# Altium project RBEComponentTester.PrjPcb
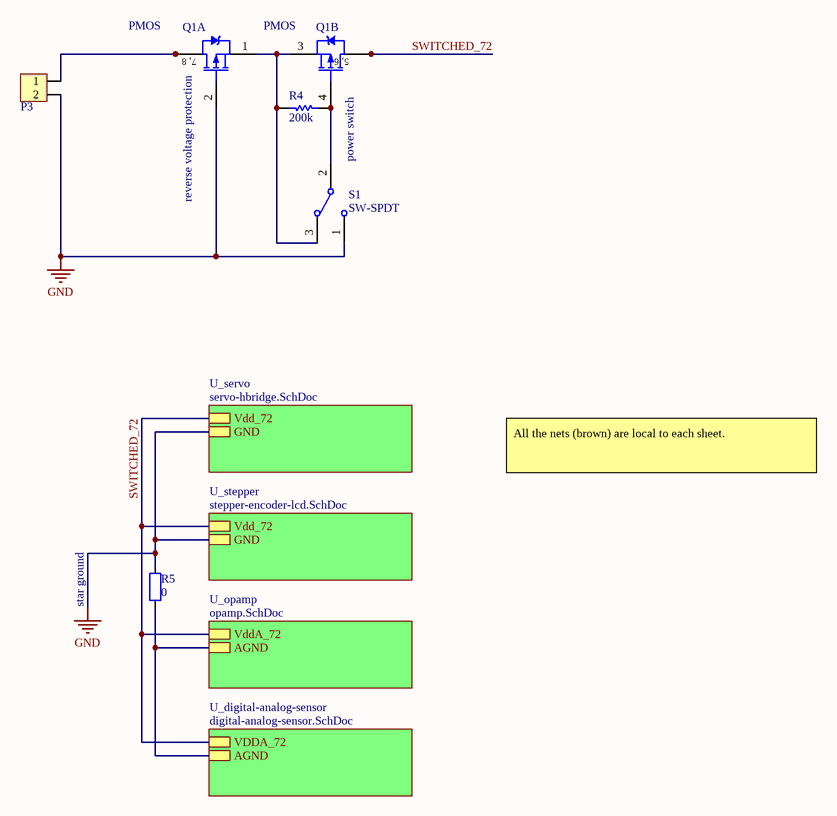
[diagram p0: main.SchDoc]
5 sheets, 127 parts. Net scope: strictly hierarchical (ports join the sheet entries above them; power ports are local).
Board file: PCB1.PcbDoc
Sheets:
  main.SchDoc
    U_digital-analog-sensor = digital-analog-sensor.SchDoc
    U_servo = servo-hbridge.SchDoc
    U_stepper = stepper-encoder-lcd.SchDoc
    U_opamp = opamp.SchDoc

## Sheet main.SchDoc
size A

### Parts
P3  2Way_5  [2Way_5]  (value not drawn)
Q1  PMOS  [SOIC_E200_8]  (parts A,B of 2)
R4  value 200k  [RES_0805]  (hidden comment: Res)
R5  value 0  [RES_0805]  (hidden comment: Res_0805)
S1  SW-SPDT  [G3T-12AH]

### Sub-sheets
U_digital-analog-sensor = digital-analog-sensor.SchDoc: VDDA_72, AGND
U_opamp = opamp.SchDoc: VddA_72, AGND
U_servo = servo-hbridge.SchDoc: Vdd_72, GND
U_stepper = stepper-encoder-lcd.SchDoc: Vdd_72, GND

### Nets
AGND: R5.1 ; sheet U_digital-analog-sensor/AGND, sheet U_opamp/AGND
GND: P3.2 Q1.2(G) R5.2 S1.1 ; sheet U_servo/GND, sheet U_stepper/GND
SWITCHED_72: Q1.5(D) Q1.6(D) ; sheet U_digital-analog-sensor/VDDA_72, sheet U_servo/Vdd_72, sheet U_stepper/Vdd_72, sheet U_opamp/VddA_72
NetP3_1: P3.1 Q1.7(D) Q1.8(D)
NetQ1_1: Q1.1(S) Q1.3(S) R4.1 S1.3
NetQ1_4: Q1.4(G) R4.2 S1.2

### Notes on the sheet
- (near Q1) reverse voltage protection
- (near Q1) power switch
- All the nets (brown) are local to each sheet.
- star ground
- (in symbol IRF7316, part A) 7, 8
- (in symbol IRF7316, part B) 5, 6

### Library data of the parts
P3 = 2Way_5: DB
Q1 = IRF7316: Dual PMOS; Published: 8-Jun-2000; LatestRevisionDate: 13-Apr-2006; LatestRevisionNote: IPC-7351 Footprint Added.; DatasheetVersion: Aug-1997; PackageVersion: Feb-2001; PackageReference: SO-8; Publisher: Altium Limited; PackageDescription: 8-Pin Plastic Small Outline Integrated Circuit 1.27 mm Pitch; Code_JEDEC: MS-012-AA; Code_IPC: SOIC127P600-8; ComponentLink1Description: Manufacturer Link; ComponentLink1URL: http://www.irf.com/; ComponentLink2Description: Datasheet; ComponentLink2URL: http://www.irf.com/product-info/datasheets/data/irf7316.pdf
R4 = Res1: Resistor; Published: 8-Jun-2000; LatestRevisionDate: 17-Jul-2002; LatestRevisionNote: Re-released for DXP Platform.; PackageReference: AXIAL-0.3; Publisher: Altium Limited
R5 = Res_0805: Resistor
S1 = SW-SPDT: SPDT Subminiature Toggle Switch, Right Angle Mounting, Vertical Actuation; Published: 24-Mar-1999; LatestRevisionDate: 17-Dec-2003; LatestRevisionNote: Schematic revised, PCB Footprint replaced.; DatasheetVersion: 05-Dec-2000; PackageReference: TL36WW15050; Publisher: Altium Limited; PackageDescription: Switch; 4 Leads; ComponentLink1Description: Manufacturer Link; ComponentLink1URL: http://www.apem.com

## Sheet digital-analog-sensor.SchDoc
size A
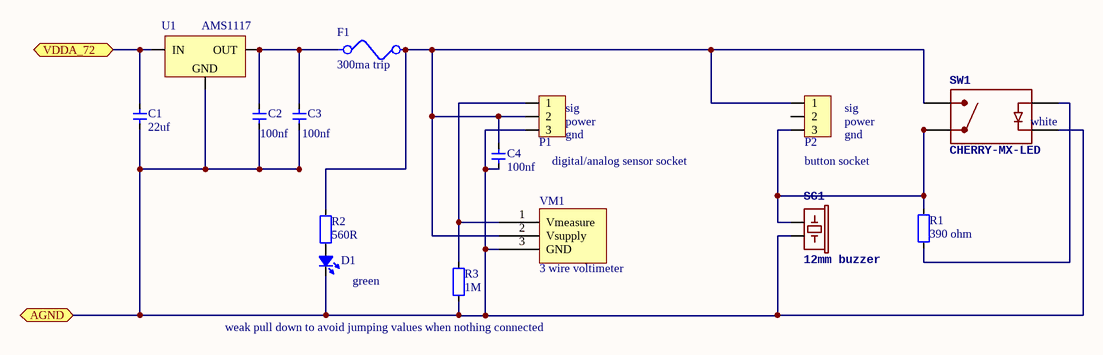
[diagram p1: digital-analog-sensor.SchDoc]

### Parts
C1  value 22uf  [CAP_0805]  (hidden comment: Cap_0805)
C2  value 100nf  [CAP_0805]  (hidden comment: Cap_0805)
C3  value 100nf  [CAP_0805]  (hidden comment: Cap_0805)
C4  value 100nf  [CAP_0805]  (hidden comment: Cap_0805)
D1  LED_0805  [LED_0805_RED]  (value not drawn)
F1  300ma trip  [Multifuse1812]
P1  HDR1x3_2.54  [HDR1X3_2.54_180]  (value not drawn)
P2  HDR1x3_2.54  [HDR1X3_2.54_180]  (value not drawn)
R1  value 390 ohm  [RES_0805]  (hidden comment: Res_0805)
R2  value 560R  [RES_0805]  (hidden comment: Res_0805)
R3  weak pull down to avoid jumping values when nothing connected  value 1M  [RES_0805]
SG1  12mm buzzer  [BUZZER-12MM]
SW1  CHERRY-MX-LED  [MX-LED]
U1  AMS1117  [SOT223-3-CONNECTEDTAB]
VM1  3 wire voltimeter  [led_meter_0.36]

### Ports
AGND, VDDA_72

### Nets
AGND: C1.1 C2.1 C3.1 C4.1 D1.2(K) P1.3 R3.1 SG1.- SW1.P$3 U1.1(GND) VM1.3(GND) ; port AGND
SWITCHED_72: C1.2 U1.3(IN) ; port VDDA_72
NetC2_2: C2.2 C3.2 F1.2 U1.2(OUT)
NetC4_2: C4.2 F1.1 P1.2 P2.1 R2.2 SW1.P$2 VM1.2(Vsupply)
NetD1_1: D1.1(A) R2.1
NetP1_1: P1.1 R3.2 VM1.1(Vmeasure)
NetP2_3: P2.3 R1.2 SG1.+ SW1.P$1
NetR1_1: R1.1 SW1.P$4

Not connected (* = marked no-connect by the designer): P2 2

### Notes on the sheet
- (near P1) digital/analog sensor socket
- (near P1) sig
- (near P1) power
- (near P1) gnd
- (near P2) button socket
- (near P2) sig
- (near P2) power
- (near P2) gnd
- (near SW1) white
- green

### Library data of the parts
C1-C4 = Cap_0805: Capacitor
D1 = LED_0805: LED
F1 = Multifuse: RO ZEK MULTI 500MA SMD 1812 MF-MSMF050-2 BOURNS; ID: Library_FUSE-0001; Faber ItemCode: 35502800; Info: MULTIFUSE, SMD, 0.5A; Value: 0.5A; Mfg: BOURNS; Mfg code: MF-MSMF050-2
P1 P2 = HDR1x3_2.54: Header
R1-R3 = Res_0805: Resistor
SG1 = BUZZERPTH
U1 = AMS1117: Power
VM1 = Voltmeter_LED_3wire

## Sheet servo-hbridge.SchDoc
size A
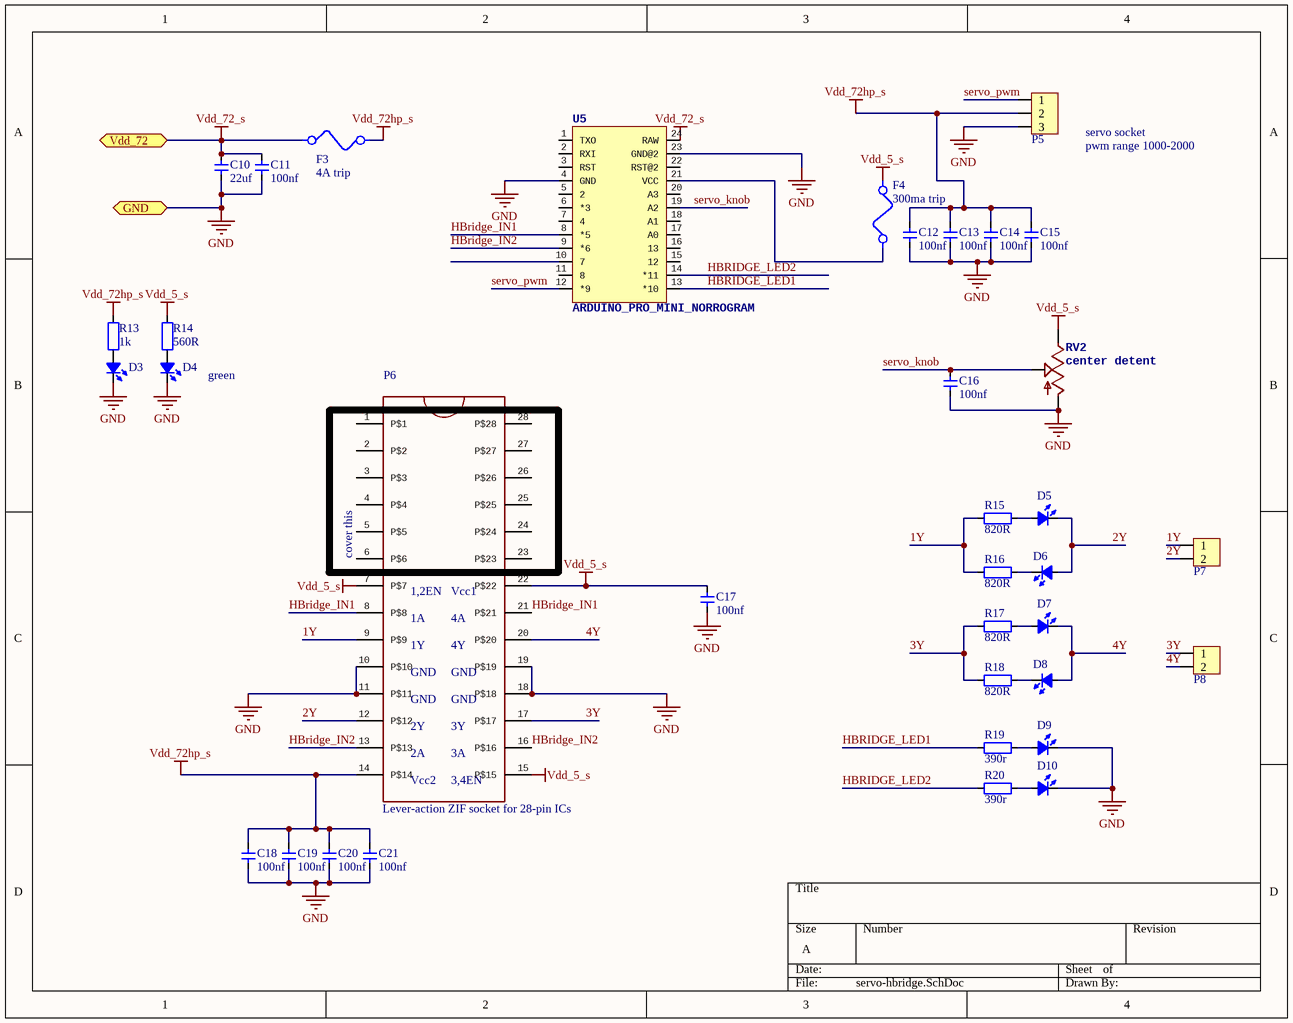
[diagram p2: servo-hbridge.SchDoc]

### Parts
C10  value 22uf  [CAP_0805]  (hidden comment: Cap_0805)
C11  value 100nf  [CAP_0805]  (hidden comment: Cap_0805)
C12  value 100nf  [CAP_0805]  (hidden comment: Cap_0805)
C13  value 100nf  [CAP_0805]  (hidden comment: Cap_0805)
C14  value 100nf  [CAP_0805]  (hidden comment: Cap_0805)
C15  value 100nf  [CAP_0805]  (hidden comment: Cap_0805)
C16  value 100nf  [CAP_0805]  (hidden comment: Cap_0805)
C17  value 100nf  [CAP_0805]  (hidden comment: Cap_0805)
C18  value 100nf  [CAP_0805]  (hidden comment: Cap_0805)
C19  value 100nf  [CAP_0805]  (hidden comment: Cap_0805)
C20  value 100nf  [CAP_0805]  (hidden comment: Cap_0805)
C21  value 100nf  [CAP_0805]  (hidden comment: Cap_0805)
D3  LED_0805  [LED_0805_RED]  (value not drawn)
D4  LED_0805  [LED_0805_RED]  (value not drawn)
D5  LED_0805  [LED_0805_YELLOW]  (value not drawn)
D6  LED_0805  [LED_0805_YELLOW]  (value not drawn)
D7  LED_0805  [LED_0805_YELLOW]  (value not drawn)
D8  LED_0805  [LED_0805_YELLOW]  (value not drawn)
D9  LED_0805  [LED_0805_YELLOW]  (value not drawn)
D10  LED_0805  [LED_0805_YELLOW]  (value not drawn)
F3  4A trip  [Multifuse1812]
F4  300ma trip  [Multifuse1812]
P5  HDR1x3_2.54  [HDR1X3_2.54_180]  (value not drawn)
P6  Lever-action ZIF socket for 28-pin ICs  [DIL28-3-ZIF_SOCKET]
P7  HDR1x2_2.54  [HDR1X2_2.54_180]  (value not drawn)
P8  HDR1x2_2.54  [HDR1X2_2.54_180]  (value not drawn)
R13  value 1k  [RES_0805]  (hidden comment: Res_0805)
R14  value 560R  [RES_0805]  (hidden comment: Res_0805)
R15  value 820R  [RES_0805]  (hidden comment: Res_0805)
R16  value 820R  [RES_0805]  (hidden comment: Res_0805)
R17  value 820R  [RES_0805]  (hidden comment: Res_0805)
R18  value 820R  [RES_0805]  (hidden comment: Res_0805)
R19  value 390r  [RES_0805]  (hidden comment: Res_0805)
R20  value 390r  [RES_0805]  (hidden comment: Res_0805)
RV2  center detent  [Bourns-slimline-axialbracket]
U5  ARDUINO_PRO_MINI_NORROGRAM  [ARDUINO_PRO_MINI_NOPROGRAM]

### Ports
GND, Vdd_72

### Nets
GND: C10.1 C11.1 C12.2 C13.2 C14.2 C15.2 C16.2 C17.1 C18.2 C19.2 C20.2 C21.2 D3.2(K) D4.2(K) D9.2(K) D10.2(K) P5.3 P6.10(P$10) P6.11(P$11) P6.18(P$18) P6.19(P$19) RV2.P$3(A) U5.4(GND) U5.23(GND@2) ; port GND
Vdd_5_s: C17.2 F4.2 P6.7(P$7) P6.15(P$15) P6.22(P$22) R14.2 RV2.P$1(E)
Vdd_72_s: C10.2 C11.2 F3.1 U5.24(RAW) ; port Vdd_72  [project net SWITCHED_72]
Vdd_72hp_s: C12.1 C13.1 C14.1 C15.1 C18.1 C19.1 C20.1 C21.1 F3.2 P5.2 P6.14(P$14) R13.2
1Y: P6.9(P$9) P7.1 R15.1 R16.1
2Y: D5.2(K) D6.1(A) P6.12(P$12) P7.2
3Y: P6.17(P$17) P8.1 R17.1 R18.1
4Y: D7.2(K) D8.1(A) P6.20(P$20) P8.2
HBridge_IN1: P6.8(P$8) P6.21(P$21) U5.8(*5)
HBridge_IN2: P6.13(P$13) P6.16(P$16) U5.9(*6)
HBRIDGE_LED1: R19.1 U5.13(*10)
HBRIDGE_LED2: R20.1 U5.14(*11)
servo_knob: C16.1 RV2.P$2(S) U5.19(A2)
servo_pwm: P5.1 U5.12(*9)
NetD3_1: D3.1(A) R13.1
NetD4_1: D4.1(A) R14.1
NetD5_1: D5.1(A) R15.2
NetD6_2: D6.2(K) R16.2
NetD7_1: D7.1(A) R17.2
NetD8_2: D8.2(K) R18.2
NetD9_1: D9.1(A) R19.2
NetD10_1: D10.1(A) R20.2
NetF4_1: F4.1 U5.21(VCC)

Not connected (* = marked no-connect by the designer): P6 1(P$1) 2(P$2) 3(P$3) 4(P$4) 5(P$5) 6(P$6) 23(P$23) 24(P$24) 25(P$25) 26(P$26) 27(P$27) 28(P$28); U5 1(TXO) 2(RXI) 3(RST) 5(2) 6(*3) 7(4) 10(7) 11(8) 15(12) 16(13) 17(A0) 18(A1) 20(A3) 22(RST@2)

### Notes on the sheet
- servo socket
- pwm range 1000-2000
- green
- (near P6) cover this
- (near P6) 1A
- (near P6) 1,2EN
- (near P6) 4A
- (near P6) Vcc1
- (near P6) GND
- (near P6) 1Y
- (near P6) 4Y
- (near P6) 2A
- (near P6) 2Y
- (near P6) 3A
- (near P6) 3Y
- (near P6) Vcc2
- (near P6) 3,4EN

### Library data of the parts
C10-C21 = Cap_0805: Capacitor
D3-D10 = LED_0805: LED
F3 F4 = Multifuse: as F1 on sheet digital-analog-sensor; Mfg: BOURNS; Mfg code: MF-MSMF050-2
P5 = HDR1x3_2.54: Header
P6 = ZIFSOCKET-28-3ZIFFSOCKET-28-3
P7 P8 = HDR1x2_2.54: Header
R13-R20 = Res_0805: Resistor
RV2 = POTALPS-KIT: pin to pad: P$1>1 P$2>2 P$3>3; PROD_ID: RES-09177

## Sheet stepper-encoder-lcd.SchDoc
size A
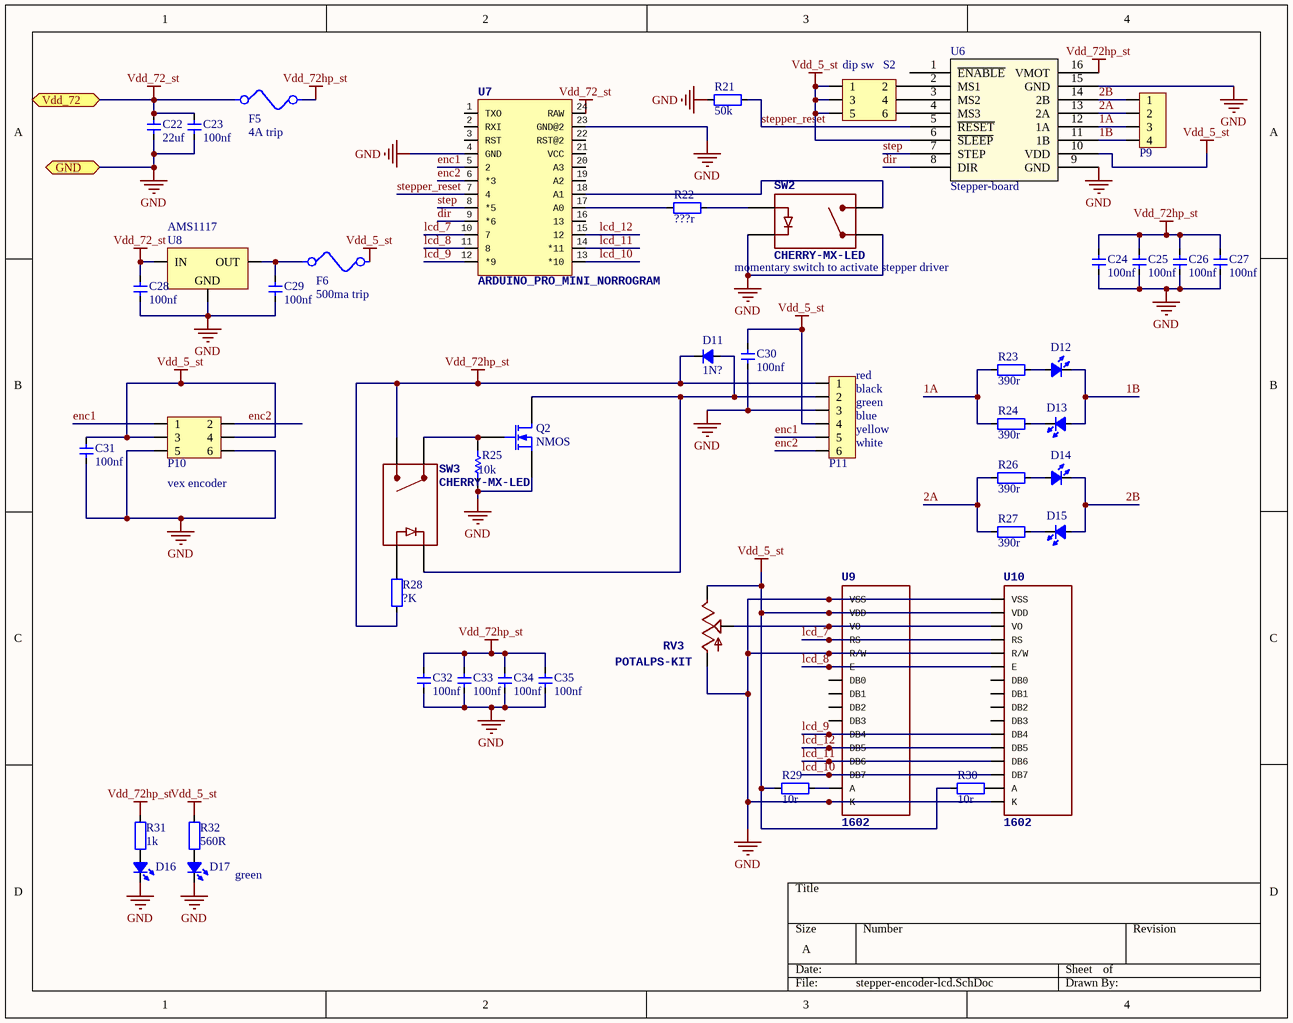
[diagram p3: stepper-encoder-lcd.SchDoc]

### Parts
C22  value 22uf  [CAP_0805]  (hidden comment: Cap_0805)
C23  value 100nf  [CAP_0805]  (hidden comment: Cap_0805)
C24  value 100nf  [CAP_0805]  (hidden comment: Cap_0805)
C25  value 100nf  [CAP_0805]  (hidden comment: Cap_0805)
C26  value 100nf  [CAP_0805]  (hidden comment: Cap_0805)
C27  value 100nf  [CAP_0805]  (hidden comment: Cap_0805)
C28  value 100nf  [CAP_0805]  (hidden comment: Cap_0805)
C29  value 100nf  [CAP_0805]  (hidden comment: Cap_0805)
C30  value 100nf  [CAP_0805]  (hidden comment: Cap_0805)
C31  value 100nf  [CAP_0805]  (hidden comment: Cap_0805)
C32  value 100nf  [CAP_0805]  (hidden comment: Cap_0805)
C33  value 100nf  [CAP_0805]  (hidden comment: Cap_0805)
C34  value 100nf  [CAP_0805]  (hidden comment: Cap_0805)
C35  value 100nf  [CAP_0805]  (hidden comment: Cap_0805)
D11  value 1N?  [SOD-323]  (hidden comment: Diode_SOD323)
D12  LED_0805  [LED_0805_YELLOW]  (value not drawn)
D13  LED_0805  [LED_0805_YELLOW]  (value not drawn)
D14  LED_0805  [LED_0805_YELLOW]  (value not drawn)
D15  LED_0805  [LED_0805_YELLOW]  (value not drawn)
D16  LED_0805  [LED_0805_RED]  (value not drawn)
D17  LED_0805  [LED_0805_RED]  (value not drawn)
F5  4A trip  [Multifuse1812]
F6  500ma trip  [Multifuse1812]
P9  HDR1x4_2.54  [HDR1x4_2.54_180]  (value not drawn)
P10  HDR2x3_2.54  [HDR2X3_2.54_180]  (value not drawn)
P11  HDR1x6_2.54  [HDR1X6_2.54_180]  (value not drawn)
Q2  NMOS  [SOT23-3]
R21  value 50k  [RES_0805]  (hidden comment: Res_0805)
R22  value ???r  [RES_0805]  (hidden comment: Res_0805)
R23  value 390r  [RES_0805]  (hidden comment: Res_0805)
R24  value 390r  [RES_0805]  (hidden comment: Res_0805)
R25  value 10k  [RES_0805]  (hidden comment: R2)
R26  value 390r  [RES_0805]  (hidden comment: Res_0805)
R27  value 390r  [RES_0805]  (hidden comment: Res_0805)
R28  value ?K  [RES_0805]  (hidden comment: Res_0805)
R29  value 10r  [RES_0805]  (hidden comment: Res_0805)
R30  value 10r  [RES_0805]  (hidden comment: Res_0805)
R31  value 1k  [RES_0805]  (hidden comment: Res_0805)
R32  value 560R  [RES_0805]  (hidden comment: Res_0805)
RV3  POTALPS-KIT  [Bourns-slimline-axialbracket]
S2  HDR2x3_2.54  [DIP6]  (value not drawn)
SW2  CHERRY-MX-LED  [MX-LED]
SW3  CHERRY-MX-LED  [MX-LED]
U6  Stepper-board  [stepper-board]
U7  ARDUINO_PRO_MINI_NORROGRAM  [ARDUINO_PRO_MINI_NOPROGRAM]
U8  AMS1117  [SOT223-3-CONNECTEDTAB]
U9  1602  [LCD-16X2_NOSILK]
U10  1602  [LCD-16X2_NOSILK]

### Ports
GND, Vdd_72

### Nets
GND: C22.1 C23.1 C24.2 C25.2 C26.2 C27.2 C28.1 C29.1 C30.2 C31.2 C32.2 C33.2 C34.2 C35.2 D16.2(K) D17.2(K) P10.5 P10.6 P11.3 Q2.3(S) R21.1 R25.1 RV3.P$3(A) SW2.P$1 SW2.P$3 U6.9(GND) U6.15(GND) U7.4(GND) U7.23(GND@2) U8.1(GND) U9.1(VSS) U9.5(R/W) U9.16(K) U10.1(VSS) U10.5(R/W) U10.16(K) ; port GND
Vdd_5_st: C30.1 C31.1 F6.2 P10.3 P10.4 P11.4 R29.1 R30.1 R32.2 RV3.P$1(E) S2.1 S2.3 S2.5 U6.6(~{SLEEP}) U6.10(VDD) U9.2(VDD) U10.2(VDD)
Vdd_72_st: C22.2 C23.2 C28.2 F5.1 U7.24(RAW) U8.3(IN) ; port Vdd_72  [project net SWITCHED_72]
Vdd_72hp_st: C24.1 C25.1 C26.1 C27.1 C32.1 C33.1 C34.1 C35.1 D11.2(K) F5.2 P11.1 R28.1 R31.2 SW3.P$2 U6.16(VMOT)
1A: P9.3 R23.1 R24.1 U6.12(1A)
1B: D12.2(K) D13.1(A) P9.4 U6.11(1B)
2A: P9.2 R26.1 R27.1 U6.13(2A)
2B: D14.2(K) D15.1(A) P9.1 U6.14(2B)
dir: U6.8(DIR) U7.9(*6)
enc1: P10.1 P11.5 U7.5(2)
enc2: P10.2 P11.6 U7.6(*3)
lcd_7: U7.10(7) U9.4(RS) U10.4(RS)
lcd_8: U7.11(8) U9.6(E) U10.6(E)
lcd_9: U7.12(*9) U9.11(DB4) U10.11(DB4)
lcd_10: U7.13(*10) U9.14(DB7) U10.14(DB7)
lcd_11: U7.14(*11) U9.13(DB6) U10.13(DB6)
lcd_12: U7.15(12) U9.12(DB5) U10.12(DB5)
step: U6.7(STEP) U7.8(*5)
stepper_reset: R21.2 U6.5(~{RESET}) U7.7(4)
NetC29_2: C29.2 F6.1 U8.2(OUT)
NetD11_1: D11.1(A) P11.2 Q2.1(D) SW3.P$3
NetD12_1: D12.1(A) R23.2
NetD13_2: D13.2(K) R24.2
NetD14_1: D14.1(A) R26.2
NetD15_2: D15.2(K) R27.2
NetD16_1: D16.1(A) R31.1
NetD17_1: D17.1(A) R32.1
NetQ2_2: Q2.2(G) R25.2 SW3.P$1
NetR22_1: R22.1 U7.17(A0)
NetR22_2: R22.2 SW2.P$4
NetR28_2: R28.2 SW3.P$4
NetR29_2: R29.2 U9.15(A)
NetR30_2: R30.2 U10.15(A)
NetRV3_P$2: RV3.P$2(S) U9.3(VO) U10.3(VO)
NetS2_2: S2.2 U6.2(MS1)
NetS2_4: S2.4 U6.3(MS2)
NetS2_6: S2.6 U6.4(MS3)
NetSW2_P$2: SW2.P$2 U7.18(A1)

Not connected (* = marked no-connect by the designer): U6 1(~{ENABLE}); U7 1(TXO) 2(RXI) 3(RST) 16(13) 19(A2) 20(A3) 21(VCC) 22(RST@2); U9 7(DB0) 8(DB1) 9(DB2) 10(DB3); U10 7(DB0) 8(DB1) 9(DB2) 10(DB3)

### Notes on the sheet
- (near S2) dip sw
- (near SW2) momentary switch to activate stepper driver
- (near P11) red
- (near P11) black
- (near P11) green
- (near P11) blue
- (near P11) yellow
- (near P10) vex encoder
- (near P11) white
- green

### Library data of the parts
C22-C35 = Cap_0805: Capacitor
D11 = Diode_SOD323: Diode
D12-D17 = LED_0805: LED
F5 F6 = Multifuse: as F1 on sheet digital-analog-sensor; Mfg: BOURNS; Mfg code: MF-MSMF050-2
P9 = HDR1x4_2.54: Header
P10 = HDR2x3_2.54: Header
P11 = HDR1x6_2.54: Header
Q2 = MOSFET-N: N-Channel MOSFET; pin to pad: 1>3 2>1 3>2; Published: 8-Jun-2000; LatestRevisionDate: 17-Jul-2002; LatestRevisionNote: Re-released for DXP Platform.; PackageVersion: 1995/1996; PackageReference: E3; Publisher: Altium Limited; PackageDescription: TO, Flat Index; 3 In-Line, Axial Leads; Body Dia. 4.6mm; Lead Dia. 0.5 mm (max)
R21-R24 R26-R32 = Res_0805: Resistor
R25 = Res1: Resistor; Published: 8-Jun-2000; LatestRevisionDate: 17-Jul-2002; LatestRevisionNote: Re-released for DXP Platform.; PackageReference: AXIAL-0.3; Publisher: Altium Limited; PackageDescription: Axial Device, Thru-Hole; 2 Leads; 0.3 in Pin Spacing
RV3 = POTALPS-KIT: pin to pad: P$1>1 P$2>2 P$3>3; PROD_ID: RES-09177
S2 = HDR2x3_2.54: Header; pin to pad: 2>6 3>2 4>5 5>3 6>4
U8 = AMS1117: Power
U9 U10 = LCD-16X2NOSILK

## Sheet opamp.SchDoc
size A
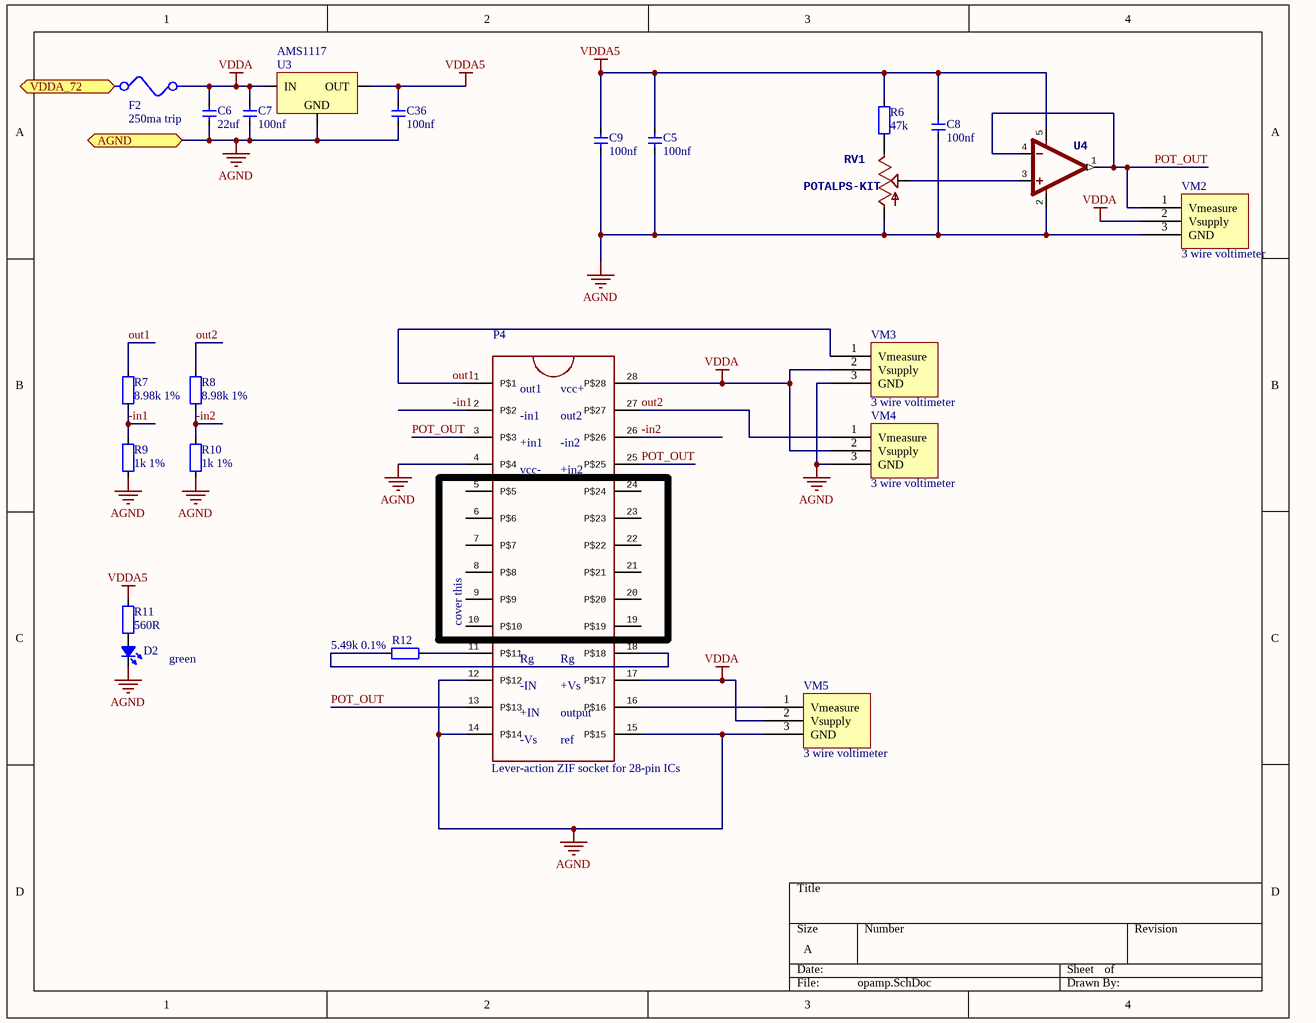
[diagram p4: opamp.SchDoc]

### Parts
C5  value 100nf  [CAP_0805]  (hidden comment: Cap_0805)
C6  value 22uf  [CAP_0805]  (hidden comment: Cap_0805)
C7  value 100nf  [CAP_0805]  (hidden comment: Cap_0805)
C8  value 100nf  [CAP_0805]  (hidden comment: Cap_0805)
C9  value 100nf  [CAP_0805]  (hidden comment: Cap_0805)
C36  value 100nf  [CAP_0805]  (hidden comment: Cap_0805)
D2  LED_0805  [LED_0805_RED]  (value not drawn)
F2  250ma trip  [Multifuse1812]
P4  Lever-action ZIF socket for 28-pin ICs  [DIL28-3-ZIF_SOCKET]
R6  value 47k  [RES_0805]  (hidden comment: Res_0805)
R7  value 8.98k 1%  [RES_0805]  (hidden comment: Res_0805)
R8  value 8.98k 1%  [RES_0805]  (hidden comment: Res_0805)
R9  value 1k 1%  [RES_0805]  (hidden comment: Res_0805)
R10  value 1k 1%  [RES_0805]  (hidden comment: Res_0805)
R11  value 560R  [RES_0805]  (hidden comment: Res_0805)
R12  value 5.49k 0.1%  [RES_0805]  (hidden comment: Res_0805)
RV1  POTALPS-KIT  [Bourns-slimline-axialbracket]
U3  AMS1117  [SOT223-3-CONNECTEDTAB]
U4  Rail to rail OpAmp with 10MHz GBP  [SOT23-5]  (value not drawn)
VM2  3 wire voltimeter  [led_meter_0.36]
VM3  3 wire voltimeter  [led_meter_0.36]
VM4  3 wire voltimeter  [led_meter_0.36]
VM5  3 wire voltimeter  [led_meter_0.36]

### Ports
AGND, VDDA_72

### Nets
AGND: C5.1 C6.1 C7.1 C8.2 C9.1 C36.1 D2.2(K) P4.4(P$4) P4.12(P$12) P4.14(P$14) P4.15(P$15) R9.1 R10.1 RV1.P$3(A) U3.1(GND) U4.2(V-) VM2.3(GND) VM3.3(GND) VM4.3(GND) VM5.3(GND) ; port AGND
SWITCHED_72: F2.1 ; port VDDA_72
VDDA: C6.2 C7.2 F2.2 P4.17(P$17) P4.28(P$28) U3.3(IN) VM2.2(Vsupply) VM3.2(Vsupply) VM4.2(Vsupply) VM5.2(Vsupply)
VDDA5: C5.2 C8.1 C9.2 C36.2 R6.1 R11.2 U3.2(OUT) U4.5(V+)
-in1: P4.2(P$2) R7.2 R9.2
-in2: P4.26(P$26) R8.2 R10.2
out1: P4.1(P$1) R7.1 VM3.1(Vmeasure)
out2: P4.27(P$27) R8.1 VM4.1(Vmeasure)
POT_OUT: P4.3(P$3) P4.13(P$13) P4.25(P$25) U4.1(OUT) U4.4(-IN) VM2.1(Vmeasure)
NetD2_1: D2.1(A) R11.1
NetP4_11: P4.11(P$11) R12.2
NetP4_16: P4.16(P$16) VM5.1(Vmeasure)
NetP4_18: P4.18(P$18) R12.1
NetR6_2: R6.2 RV1.P$1(E)
NetRV1_P$2: RV1.P$2(S) U4.3(+IN)

Not connected (* = marked no-connect by the designer): P4 5(P$5) 6(P$6) 7(P$7) 8(P$8) 9(P$9) 10(P$10) 19(P$19) 20(P$20) 21(P$21) 22(P$22) 23(P$23) 24(P$24)

### Notes on the sheet
- (near P4) out1
- (near P4) -in1
- (near P4) out2
- (near P4) vcc+
- (near P4) +in1
- (near P4) vcc-
- (near P4) -in2
- (near P4) +in2
- cover this
- green
- (near P4) -IN
- (near P4) Rg
- (near P4) +Vs
- (near P4) +IN
- (near P4) -Vs
- (near P4) output
- (near P4) ref

### Library data of the parts
C5-C9 C36 = Cap_0805: Capacitor
D2 = LED_0805: LED
F2 = Multifuse: as F1 on sheet digital-analog-sensor; Mfg: BOURNS; Mfg code: MF-MSMF050-2
P4 = ZIFSOCKET-28-3ZIFFSOCKET-28-3
R6-R12 = Res_0805: Resistor
RV1 = POTALPS-KIT: pin to pad: P$1>1 P$2>2 P$3>3; PROD_ID: RES-09177
U3 = AMS1117: Power
U4 = MCP6291T-E/OT: PROD_ID: IC-11991
VM2-VM5 = Voltmeter_LED_3wire

## Nets that join several sheets
AGND: main (R5.1), digital-analog-sensor (11 pins), opamp (20 pins)
GND: main (P3.2 Q1.2 R5.2 S1.1), servo-hbridge (24 pins), stepper-encoder-lcd (36 pins)
SWITCHED_72: main (Q1.5 Q1.6), digital-analog-sensor (C1.2 U1.3), servo-hbridge (C10.2 C11.2 F3.1 U5.24), stepper-encoder-lcd (6 pins), opamp (F2.1)